# EAGLE design csa_etholi-v1.0b (EAGLE 4.15)
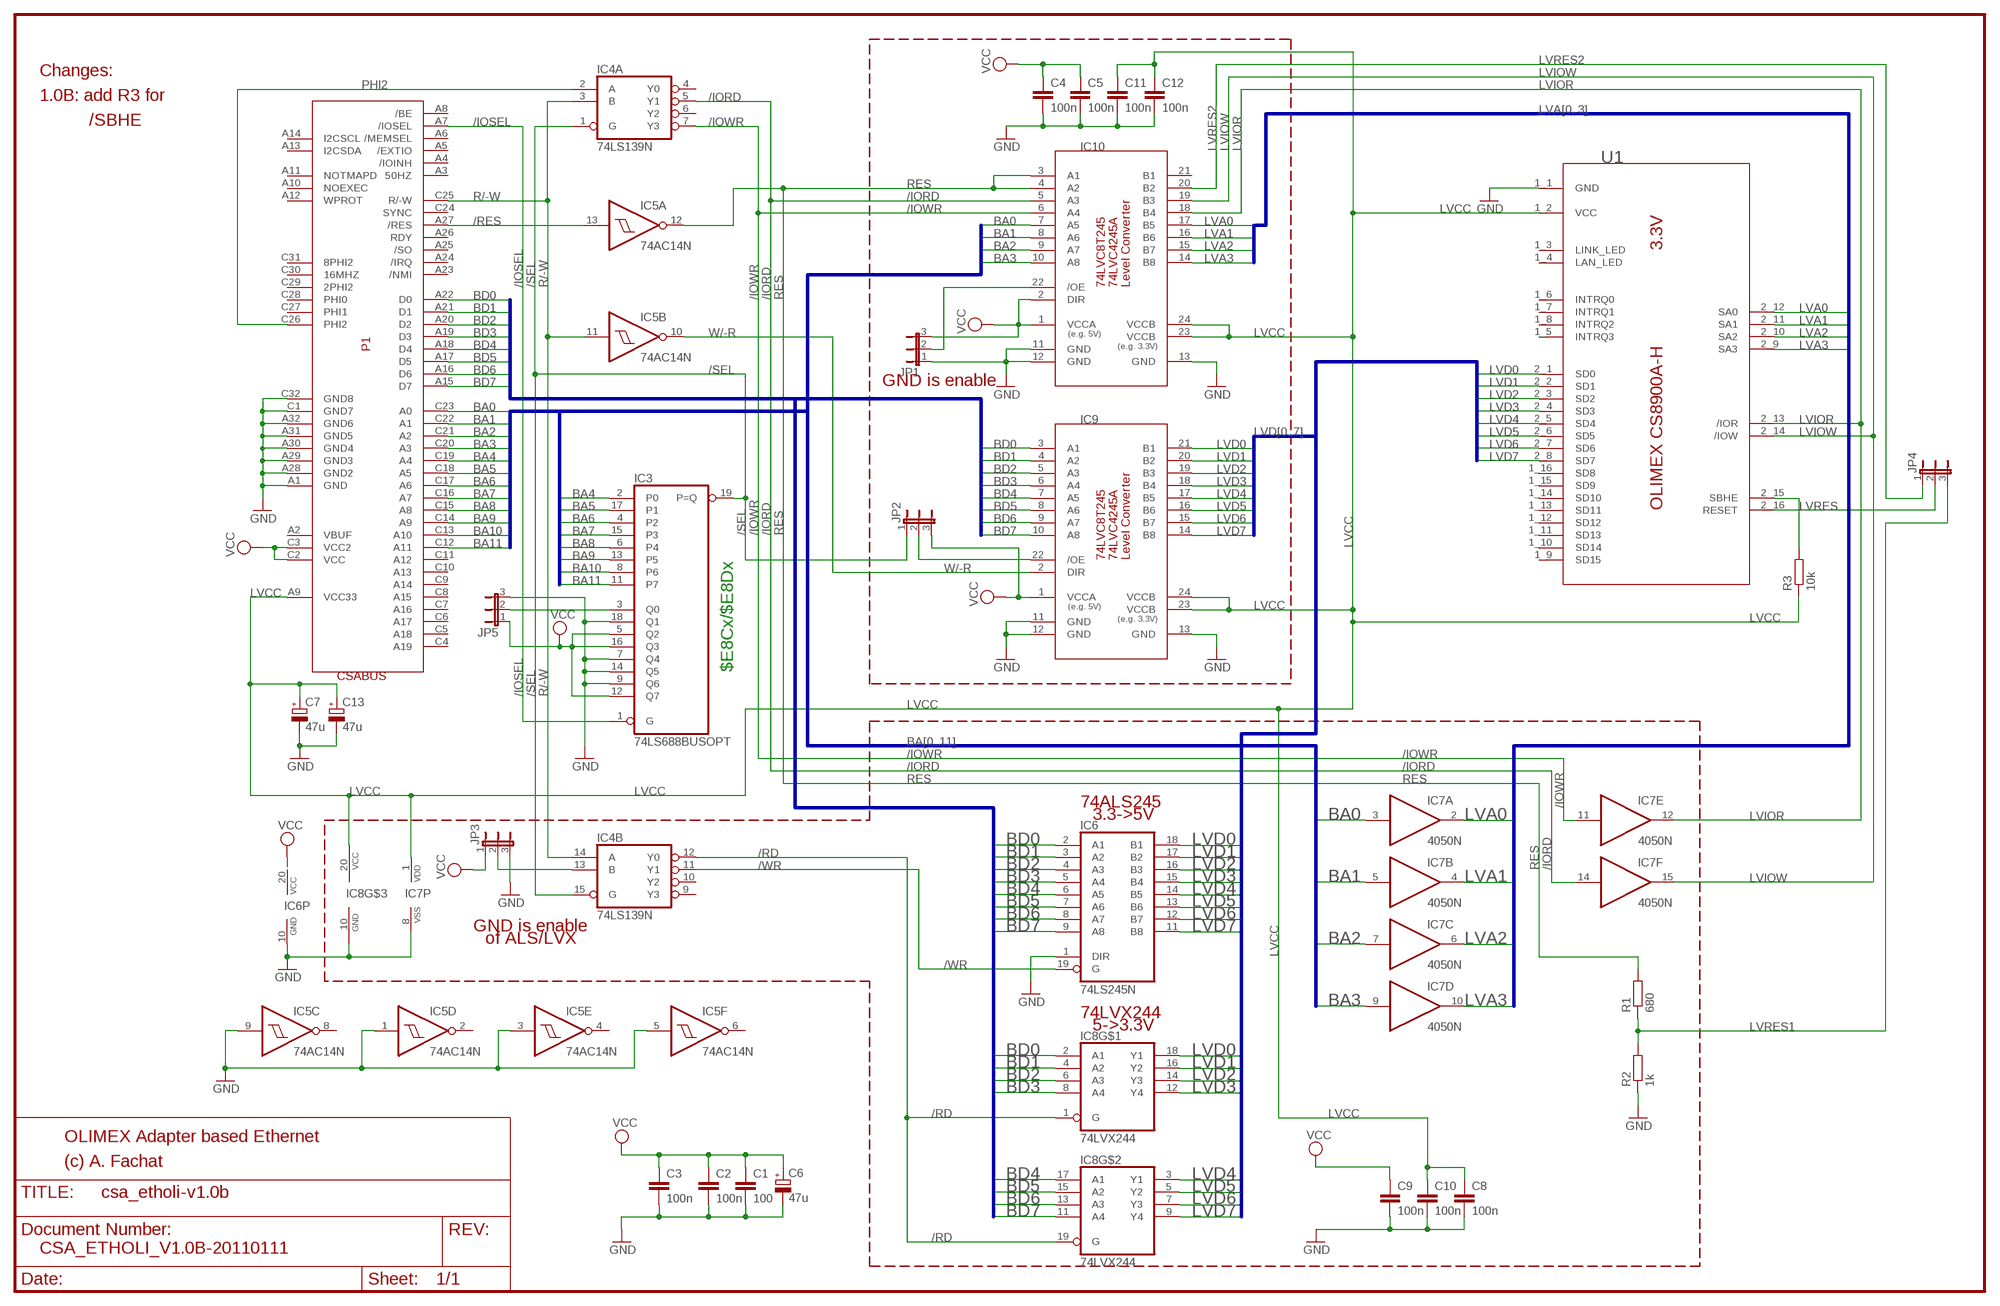
[diagram p0: schematic, sheet 1]

## Parts
C1  100  C-EU025-030X050  [C025-030X050]
C2  100n  C-EU025-030X050  [C025-030X050]
C3  100n  C-EU025-030X050  [C025-030X050]
C4  100n  C-EU025-030X050  [C025-030X050]
C5  100n  C-EU025-030X050  [C025-030X050]
C6  47u  CPOL-EUE3.5-8  [E3,5-8]
C7  47u  CPOL-EUE3.5-8  [E3,5-8]
C8  100n  C-EU025-030X050  [C025-030X050]
C9  100n  C-EU025-030X050  [C025-030X050]
C10  100n  C-EU025-030X050  [C025-030X050]
C11  100n  C-EU025-030X050  [C025-030X050]
C12  100n  C-EU025-030X050  [C025-030X050]
C13  47u  CPOL-EUE3.5-8  [E3,5-8]
IC3  74LS688BUSOPT  [DIL20]
IC4  74LS139N  [DIL16]
IC5  74AC14N  [DIL14]
IC6  74LS245N  [DIL20]
IC7  4050N  [DIL16]
IC8  74LVX244  [SO20L]
IC9  74LVC8T245SO24  [SO24L]
IC10  74LVC8T245SO24  [SO24L]
JP1  JP2E  [JP2]
JP2  JP2E  [JP2]
JP3  JP2E  [JP2]
JP4  JP2E  [JP2]
JP5  JP2E  [JP2]
P1  CSABUS  [CSABUS]
R1  680  R-EU_0207/7  [0207/7]
R2  1k  R-EU_0207/7  [0207/7]
R3  10k  R-EU_0207/7  [0207/7]
U1  ETHOLIMEX  [ETHOLIMEX]

## Nets
/IORD: IC4.5(A:Y1) IC7.14(F:I) IC10.5(A3)
/IOSEL: IC3.1(G) P1.A7(/IOSEL)
/IOWR: IC4.7(A:Y3) IC7.11(E:I) IC10.6(A4)
/RD: IC4.12(B:Y0) IC8.1(G) IC8.19(G)
/RES: IC5.13(A:I) P1.A27(/RES)
/SEL: IC3.19(P=Q) IC4.1(A:G) IC4.15(B:G) JP2.1
/WR: IC4.11(B:Y1) IC6.19(G)
BA0: IC7.3(A:I) IC10.7(A5) P1.C23(A0)
BA1: IC7.5(B:I) IC10.8(A6) P1.C22(A1)
BA2: IC7.7(C:I) IC10.9(A7) P1.C21(A2)
BA3: IC7.9(D:I) IC10.10(A8) P1.C20(A3)
BA4: IC3.2(P0) P1.C19(A4)
BA5: IC3.17(P1) P1.C18(A5)
BA6: IC3.4(P2) P1.C17(A6)
BA7: IC3.15(P3) P1.C16(A7)
BA8: IC3.6(P4) P1.C15(A8)
BA9: IC3.13(P5) P1.C14(A9)
BA10: IC3.8(P6) P1.C13(A10)
BA11: IC3.11(P7) P1.C12(A11)
BD0: IC6.2(A1) IC8.2(A1) IC9.3(A1) P1.A22(D0)
BD1: IC6.3(A2) IC8.4(A2) IC9.4(A2) P1.A21(D1)
BD2: IC6.4(A3) IC8.6(A3) IC9.5(A3) P1.A20(D2)
BD3: IC6.5(A4) IC8.8(A4) IC9.6(A4) P1.A19(D3)
BD4: IC6.6(A5) IC8.17(A1) IC9.7(A5) P1.A18(D4)
BD5: IC6.7(A6) IC8.15(A2) IC9.8(A6) P1.A17(D5)
BD6: IC6.8(A7) IC8.13(A3) IC9.9(A7) P1.A16(D6)
BD7: IC6.9(A8) IC8.11(A4) IC9.10(A8) P1.A15(D7)
GND: C1.2 C2.2 C3.2 C4.2 C5.2 C6.- C7.- C8.2 C9.2 C10.2 C11.2 C12.2 C13.- IC3.7(Q4) IC3.9(Q6) IC3.14(Q5) IC3.18(Q1) IC5.1(D:I) IC5.3(E:I) IC5.5(F:I) IC5.9(C:I) IC6.1(DIR) IC6.10(GND) IC7.8(P:VSS) IC8.10(GND) IC9.11(GND) IC9.12(GND) IC9.13(GND) IC10.11(GND) IC10.12(GND) IC10.13(GND) JP1.1 JP3.3 JP5.3 P1.A1(GND) P1.A28(GND2) P1.A29(GND3) P1.A30(GND4) P1.A31(GND5) P1.A32(GND6) P1.C1(GND7) P1.C32(GND8) R2.1 U1.1_1(GND)
LVA0: IC7.2(A:O) IC10.17(B5) U1.2_12(SA0)
LVA1: IC7.4(B:O) IC10.16(B6) U1.2_11(SA1)
LVA2: IC7.6(C:O) IC10.15(B7) U1.2_10(SA2)
LVA3: IC7.10(D:O) IC10.14(B8) U1.2_9(SA3)
LVCC: C7.+ C8.1 C10.1 C11.1 C12.1 C13.+ IC7.1(P:VDD) IC8.20(VCC) IC9.23(VCCB) IC9.24(VCCB) IC10.23(VCCB) IC10.24(VCCB) P1.A9(VCC33) R3.1 U1.1_2(VCC)
LVD0: IC6.18(B1) IC8.18(Y1) IC9.21(B1) U1.2_1(SD0)
LVD1: IC6.17(B2) IC8.16(Y2) IC9.20(B2) U1.2_2(SD1)
LVD2: IC6.16(B3) IC8.14(Y3) IC9.19(B3) U1.2_3(SD2)
LVD3: IC6.15(B4) IC8.12(Y4) IC9.18(B4) U1.2_4(SD3)
LVD4: IC6.14(B5) IC8.3(Y1) IC9.17(B5) U1.2_5(SD4)
LVD5: IC6.13(B6) IC8.5(Y2) IC9.16(B6) U1.2_6(SD5)
LVD6: IC6.12(B7) IC8.7(Y3) IC9.15(B7) U1.2_7(SD6)
LVD7: IC6.11(B8) IC8.9(Y4) IC9.14(B8) U1.2_8(SD7)
LVIOR: IC7.12(E:O) IC10.18(B4) U1.2_13(/IOR)
LVIOW: IC7.15(F:O) IC10.19(B3) U1.2_14(/IOW)
LVRES: JP4.2 U1.2_16(RESET)
LVRES1: JP4.3 R1.1 R2.2
LVRES2: IC10.20(B2) JP4.1
N$1: IC3.3(Q0) JP5.2
N$2: R3.2 U1.2_15(SBHE)
N$14: IC4.13(B:B) JP3.2
N$15: IC10.22(/OE) JP1.2
N$16: IC9.22(/OE) JP2.2
PHI2: IC4.2(A:A) P1.C26(PHI2)
R/-W: IC4.3(A:B) IC4.14(B:A) IC5.11(B:I) P1.C25(R/-W)
RES: IC5.12(A:O) IC10.3(A1) IC10.4(A2) R1.2
VCC: C1.1 C2.1 C3.1 C4.1 C5.1 C6.+ C9.1 IC3.5(Q2) IC3.12(Q7) IC3.16(Q3) IC6.20(VCC) IC9.1(VCCA) IC10.1(VCCA) IC10.2(DIR) JP1.3 JP2.3 JP3.1 JP5.1 P1.C2(VCC) P1.C3(VCC2)
W/-R: IC5.10(B:O) IC9.2(DIR)
Unconnected: IC4.4(A:Y0) IC4.6(A:Y2) IC4.9(B:Y3) IC4.10(B:Y2) IC5.2(D:O) IC5.4(E:O) IC5.6(F:O) IC5.8(C:O) IC10.21(B1) P1.A2(VBUF) P1.A3(50HZ) P1.A4(/IOINH) P1.A5(/EXTIO) P1.A6(/MEMSEL) P1.A8(/BE) P1.A10(NOEXEC) P1.A11(NOTMAPD) P1.A12(WPROT) P1.A13(I2CSDA) P1.A14(I2CSCL) P1.A23(/NMI) P1.A24(/IRQ) P1.A25(/SO) P1.A26(RDY) P1.C4(A19) P1.C5(A18) P1.C6(A17) P1.C7(A16) P1.C8(A15) P1.C9(A14) P1.C10(A13) P1.C11(A12) P1.C24(SYNC) P1.C27(PHI1) P1.C28(PHI0) P1.C29(2PHI2) P1.C30(16MHZ) P1.C31(8PHI2) U1.1_3(LINK_LED) U1.1_4(LAN_LED) U1.1_5(INTRQ3) U1.1_6(INTRQ0) U1.1_7(INTRQ1) U1.1_8(INTRQ2) U1.1_9(SD15) U1.1_10(SD14) U1.1_11(SD13) U1.1_12(SD12) U1.1_13(SD11) U1.1_14(SD10) U1.1_15(SD9) U1.1_16(SD8)

## Buses
LVD[0..7]
BD[0..7]
BA[0..11]
LVA[0..3]

## Notes on the sheet
- Changes:
- 1.0B: add R3 for
- /SBHE
- GND is enable
- $E8Cx/$E8Dx
- 74ALS245
- 3.3->5V
- GND is enable
- of ALS/LVX
- 74LVX244
- 5->3.3V
- OLIMEX Adapter based Ethernet
- (c) A. Fachat
- CSA_ETHOLI_V1.0B-20110111

## Power pins joined to a net without a drawn wire
GND: IC3.10(GND) IC4.8(P:GND) IC5.7(P:GND)
VCC: IC3.20(VCC) IC4.16(P:VCC) IC5.14(P:VCC)

## Library data of the parts
C1-C5 C8-C12 = rcl:C-EU: CAPACITOR, European symbol
C6 C7 C13 = rcl:CPOL-EU: POLARIZED CAPACITOR, European symbol
IC3 = csa:74LS688BUSOPT
IC4 = 74xx-us:74*139: Dual 2-line to 4-line DECODER/DEMULTIPLEXER
IC5 = 74xx-eu:74*14: Hex schmitt trigger INVERTER
IC6 = 74xx-eu:74*245: Octal BUS TRANSCEIVER, 3-state
IC7 = 40xx:4050: Hex non-inverting BUFFER
IC8 = csa:74LVX244
IC9 IC10 = csa:74LVC8T245
JP1-JP5 = jumper:JP2E: JUMPER
P1 = csa:CSABUS
R1-R3 = rcl:R-EU_: RESISTOR, European symbol
U1 = csa:ETHOLIMEX

## Board
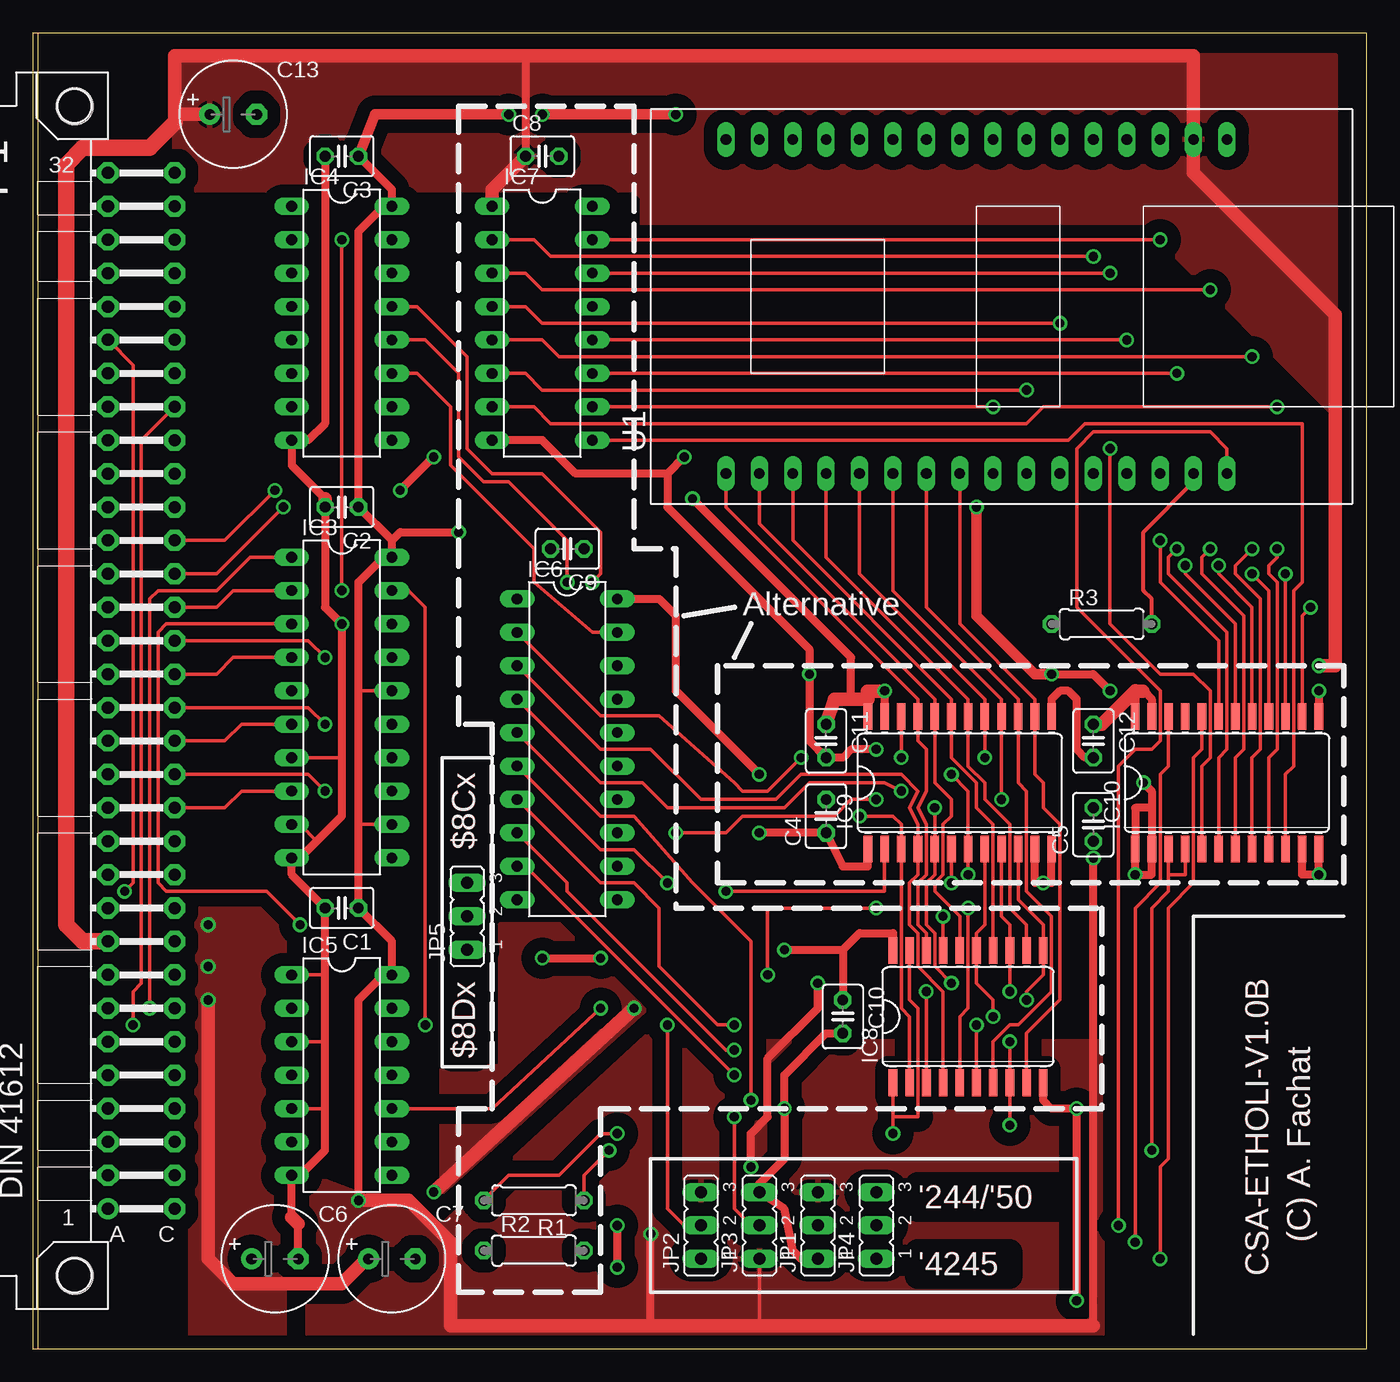
[diagram p1: board, top side]
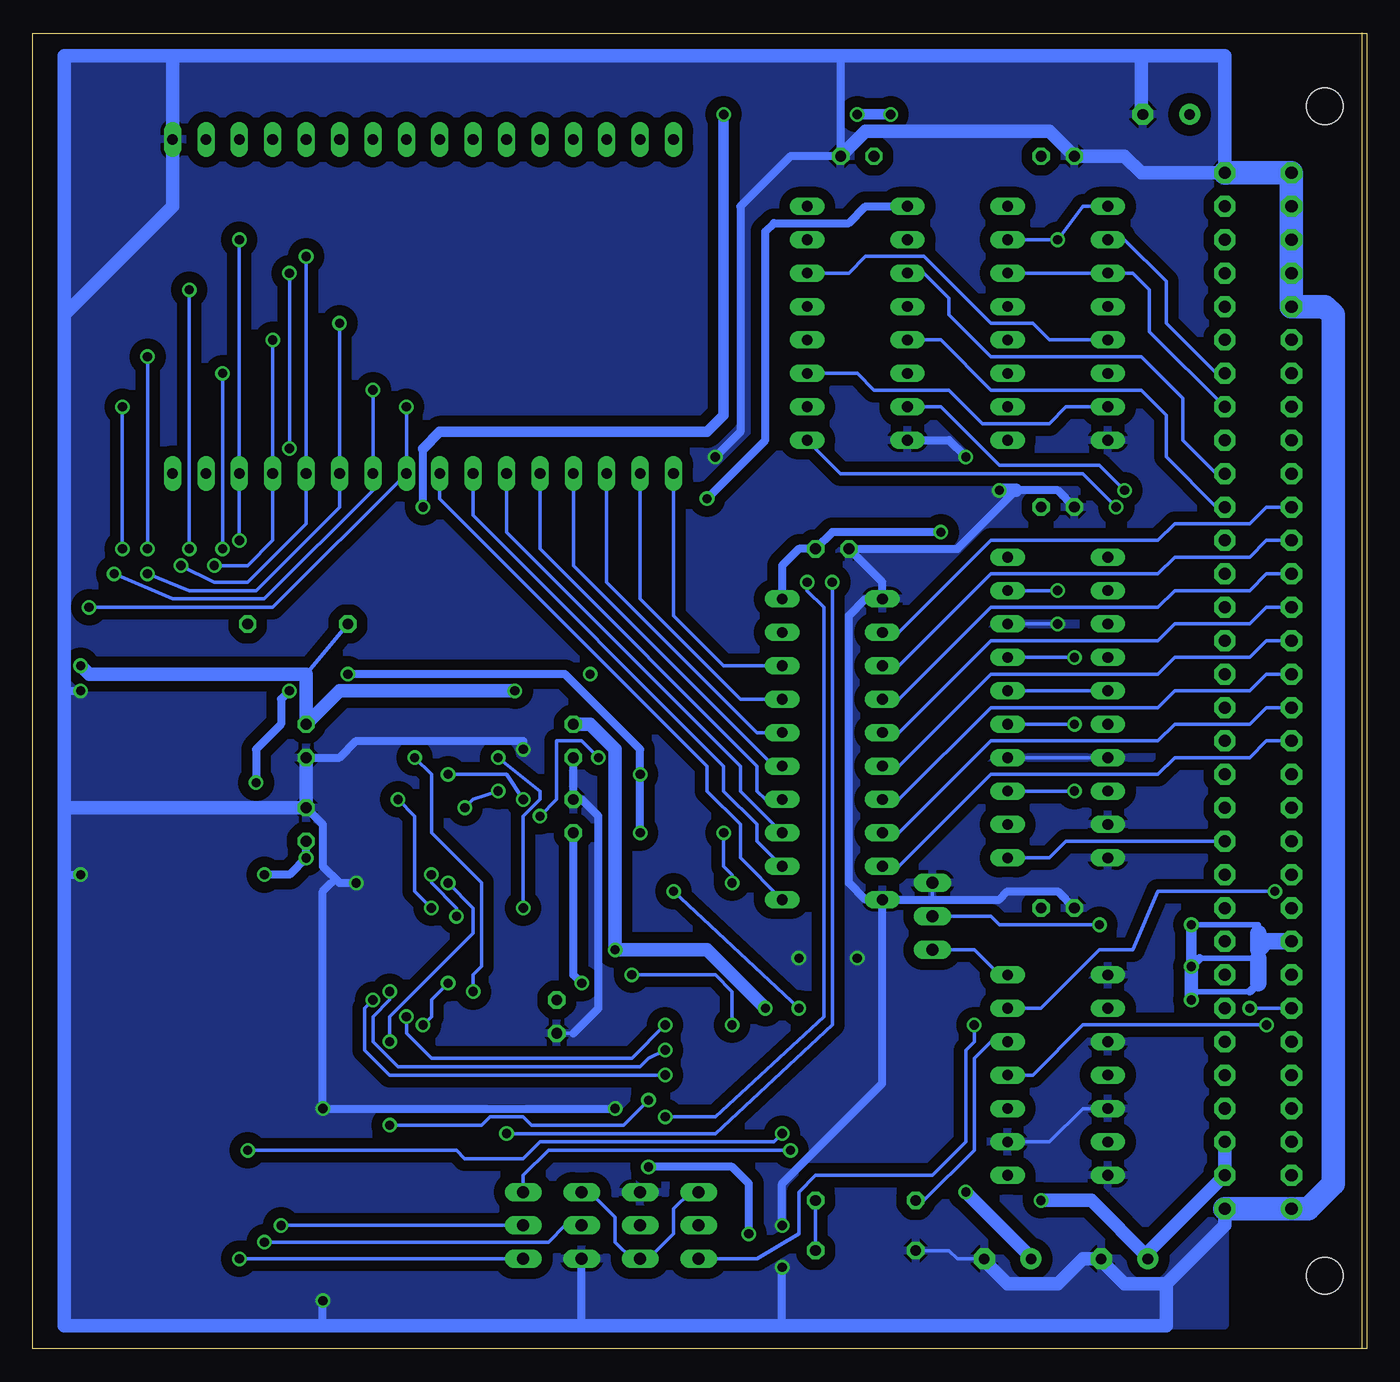
[diagram p2: board, bottom side, seen from below]

Size 101.42 x 100.03 mm. Coordinates in mm from the lower left corner, seen from the top.
Outline: 0,0.01 101.42,0.01 101.42,100.01 0,100.01 0,0.01
Copper layers (1*16): Top 0.035mm / dielectric 1.5mm / Bottom 0.035mm
Design rules "default": minimum track width 10mil, minimum drill 24mil, track to track 6mil, track to pad 6mil, pad to pad 8mil, via to via 8mil, smd to smd 8mil, copper to edge 40mil, drill to drill 8mil, minimum pad ring 10mil, minimum via ring 8mil, stop-mask expansion 4mil, vias tented up to drill 0mil, thermal gap 10mil

### Footprints (pad centres in the part's own frame; a part is rotated, then mirrored left to right if it is on the bottom)
C025-030X050 = drill 0.813 octagon: 1 -1.27,0; 2 1.27,0
E3,5-8 = drill 0.813 pad 1.6 round: + -1.778,0 | drill 0.813 pad 1.6 octagon: - 1.778,0
DIL20 = drill 0.813 long: 1 -10.16,-3.81; 2 -7.62,-3.81; 3 -5.08,-3.81; 4 -2.54,-3.81; 5 0,-3.81; 6 2.54,-3.81; 7 5.08,-3.81; 8 7.62,-3.81; 9 10.16,-3.81; 10 12.7,-3.81; 11 12.7,3.81; 12 10.16,3.81; 13 7.62,3.81; 14 5.08,3.81; 15 2.54,3.81; 16 0,3.81; 17 -2.54,3.81; 18 -5.08,3.81; 19 -7.62,3.81; 20 -10.16,3.81
DIL16 = drill 0.813 long: 1 -8.89,-3.81; 2 -6.35,-3.81; 3 -3.81,-3.81; 4 -1.27,-3.81; 5 1.27,-3.81; 6 3.81,-3.81; 7 6.35,-3.81; 8 8.89,-3.81; 9 8.89,3.81; 10 6.35,3.81; 11 3.81,3.81; 12 1.27,3.81; 13 -1.27,3.81; 14 -3.81,3.81; 15 -6.35,3.81; 16 -8.89,3.81
DIL14 = drill 0.813 long: 1 -7.62,-3.81; 2 -5.08,-3.81; 3 -2.54,-3.81; 4 0,-3.81; 5 2.54,-3.81; 6 5.08,-3.81; 7 7.62,-3.81; 8 7.62,3.81; 9 5.08,3.81; 10 2.54,3.81; 11 0,3.81; 12 -2.54,3.81; 13 -5.08,3.81; 14 -7.62,3.81
DIL20' = drill 0.813 long: 1 -11.43,-3.81; 2 -8.89,-3.81; 3 -6.35,-3.81; 4 -3.81,-3.81; 5 -1.27,-3.81; 6 1.27,-3.81; 7 3.81,-3.81; 8 6.35,-3.81; 9 8.89,-3.81; 10 11.43,-3.81; 11 11.43,3.81; 12 8.89,3.81; 13 6.35,3.81; 14 3.81,3.81; 15 1.27,3.81; 16 -1.27,3.81; 17 -3.81,3.81; 18 -6.35,3.81; 19 -8.89,3.81; 20 -11.43,3.81
SO20L = smd 0.66 x 2.032: 1 0,-5.029; 2 1.27,-5.029; 3 2.54,-5.029; 4 3.81,-5.029; 5 5.08,-5.029; 6 6.35,-5.029; 7 7.62,-5.029; 8 8.89,-5.029; 9 10.16,-5.029; 10 11.43,-5.029; 11 11.43,5.029; 12 10.16,5.029; 13 8.89,5.029; 14 7.62,5.029; 15 6.35,5.029; 16 5.08,5.029; 17 3.81,5.029; 18 2.54,5.029; 19 1.27,5.029; 20 0,5.029
SO24L = smd 0.66 x 2.032: 1 -3.81,-5.029; 2 -2.54,-5.029; 3 -1.27,-5.029; 4 0,-5.029; 5 1.27,-5.029; 6 2.54,-5.029; 7 3.81,-5.029; 8 5.08,-5.029; 9 6.35,-5.029; 10 7.62,-5.029; 11 8.89,-5.029; 12 10.16,-5.029; 13 10.16,5.029; 14 8.89,5.029; 15 7.62,5.029; 16 6.35,5.029; 17 5.08,5.029; 18 3.81,5.029; 19 2.54,5.029; 20 1.27,5.029; 21 0,5.029; 22 -1.27,5.029; 23 -2.54,5.029; 24 -3.81,5.029
JP2 = drill 0.914 long: 1 -2.54,0; 2 0,0; 3 2.54,0
CSABUS = drill 0.914 pad 1.6 round: A1 7.62,36.83 | drill 0.914 pad 1.6 octagon: A2 7.62,34.29; A3 7.62,31.75; A4 7.62,29.21; A5 7.62,26.67; A6 7.62,24.13; A7 7.62,21.59; A8 7.62,19.05; A9 7.62,16.51; A10 7.62,13.97; A11 7.62,11.43; A12 7.62,8.89; A13 7.62,6.35; A14 7.62,3.81; A15 7.62,1.27; A16 7.62,-1.27; A17 7.62,-3.81; A18 7.62,-6.35; A19 7.62,-8.89; A20 7.62,-11.43; A21 7.62,-13.97; A22 7.62,-16.51; A23 7.62,-19.05; A24 7.62,-21.59; A25 7.62,-24.13; A26 7.62,-26.67; A27 7.62,-29.21; A28 7.62,-31.75; A29 7.62,-34.29; A30 7.62,-36.83; A31 7.62,-39.37; A32 7.62,-41.91; C1 2.54,36.83; C2 2.54,34.29; C3 2.54,31.75; C4 2.54,29.21; C5 2.54,26.67; C6 2.54,24.13; C7 2.54,21.59; C8 2.54,19.05; C9 2.54,16.51; C10 2.54,13.97; C11 2.54,11.43; C12 2.54,8.89; C13 2.54,6.35; C14 2.54,3.81; C15 2.54,1.27; C16 2.54,-1.27; C17 2.54,-3.81; C18 2.54,-6.35; C19 2.54,-8.89; C20 2.54,-11.43; C21 2.54,-13.97; C22 2.54,-16.51; C23 2.54,-19.05; C24 2.54,-21.59; C25 2.54,-24.13; C26 2.54,-26.67; C27 2.54,-29.21; C28 2.54,-31.75; C29 2.54,-34.29; C30 2.54,-36.83; C31 2.54,-39.37; C32 2.54,-41.91 | hole 2.794: 10.16,41.91; 10.16,-46.99
0207/7 = drill 0.813 octagon: 1 -3.81,0; 2 3.81,0
ETHOLIMEX = drill 0.813 long: 1_1 20.32,17.78; 1_2 17.78,17.78; 1_3 15.24,17.78; 1_4 12.7,17.78; 1_5 10.16,17.78; 1_6 7.62,17.78; 1_7 5.08,17.78; 1_8 2.54,17.78; 1_9 0,17.78; 1_10 -2.54,17.78; 1_11 -5.08,17.78; 1_12 -7.62,17.78; 1_13 -10.16,17.78; 1_14 -12.7,17.78; 1_15 -15.24,17.78; 1_16 -17.78,17.78; 2_1 -17.78,-7.62; 2_2 -15.24,-7.62; 2_3 -12.7,-7.62; 2_4 -10.16,-7.62; 2_5 -7.62,-7.62; 2_6 -5.08,-7.62; 2_7 -2.54,-7.62; 2_8 0,-7.62; 2_9 2.54,-7.62; 2_10 5.08,-7.62; 2_11 7.62,-7.62; 2_12 10.16,-7.62; 2_13 12.7,-7.62; 2_14 15.24,-7.62; 2_15 17.78,-7.62; 2_16 20.32,-7.62

### Placement (x,y rotation side)
C1  23.49,33.5 180 top
C2  23.49,63.98 180 top
C3  23.49,90.65 180 top
C4  60.32,40.49 90 top
C5  80.64,39.85 90 top
C6  18.41,6.83 0 top
C7  27.3,6.83 0 top
C8  38.73,90.65 0 top
C9  40.64,60.81 180 top
C10  61.59,25.25 270 top
C11  60.32,46.2 270 top
C12  80.64,46.2 270 top
C13  15.24,93.83 0 top
IC3  23.49,50.01 270 top
IC4  23.49,77.95 270 top
IC5  23.49,20.8 270 top
IC6  74LS245N  [DIL20']  40.64,45.57 270 top
IC7  38.73,77.95 270 top
IC8  65.4,25.25 0 top
IC9  67.3,43.03 0 top
IC10  87.62,43.03 0 top
JP1  59.69,9.37 90 top
JP2  50.8,9.37 90 top
JP3  55.24,9.37 90 top
JP4  64.13,9.37 90 top
JP5  33.02,32.87 90 top
P1  13.33,47.47 180 top
R1  38.1,11.28 180 top
R2  38.1,7.47 0 top
R3  81.27,55.09 0 top
U1  70.48,74.14 0 top

### Tracks (layer width: path | path; a pad name or v marks a point on that pad's centre or on a via)
/IORD  (via drill 0.7)
  Top 0.254: IC10.5 88.89,44.3 89.53,44.93 89.53,50.01 88.26,51.28 85.72,51.28 81.91,55.09 v81.91,68.43 | IC7.14 v81.91,81.76
  Bottom 0.254: IC4.5 24.12,76.68 25.39,77.95 28.57,77.95 33.65,83.03 38.1,83.03 39.37,81.76 IC7.14 | v81.91,81.76 v81.91,68.43
/IOSEL  (via drill 0.7)
  Top 0.254: v8.89,25.88 8.89,57 9.52,57.63 13.97,57.63 16.5,60.17 IC3.1
  Bottom 0.254: P1.A7 v8.89,25.88
/IOWR  (via drill 0.7)
  Top 0.254: IC10.6 90.16,44.93 90.8,45.57 90.8,54.46 86.35,58.9 86.35,60.17 v86.99,60.81 | IC7.11 v86.99,74.14
  Bottom 0.254: v86.99,74.14 v86.99,60.81 | IC4.7 22.86,71.6 24.12,70.33 29.2,70.33 31.74,72.87 37.46,72.87 38.73,74.14 IC7.11
/RD  (via drill 0.7)
  Top 0.254: 65.4,17.63 IC8.1 | 65.4,17.63 67.3,17.63 67.3,25.88 66.67,26.52 IC8.19 66.67,30.33 | IC4.12 29.84,76.68 32.38,74.14 32.38,67.79 34.29,65.89 36.19,65.89 40.64,61.44 v40.64,58.27 | v65.4,16.36 65.4,17.63
  Bottom 0.254: v40.64,58.27 40.64,24.61 49.53,16.36 v65.4,16.36
/RES  (via drill 0.7)
  Top 0.254: P1.A27 7.62,74.78 7.62,35.41 v6.98,34.77
  Bottom 0.254: v6.98,34.77 15.87,34.77 17.77,30.33 20.31,30.33 24.76,25.88 IC5.13
/SEL  (via drill 0.7)
  Top 0.254: v23.49,57.63 v23.49,84.3 | IC3.19 28.57,57.63 29.84,56.36 v29.84,24.61
  Bottom 0.254: IC4.1 21.58,86.84 v23.49,84.3 IC4.15 | IC3.19 v23.49,57.63 | v29.84,24.61 29.84,23.34 30.47,22.71 30.47,15.72 33.02,13.18 41.91,13.18 43.18,11.91 43.18,8.74 46.35,6.83 JP2.1
/WR
  Top 0.254: IC4.11 29.2,74.14 31.74,71.6 31.74,67.16 38.1,60.81 38.1,58.27 42.54,54.46 IC6.19
BA0  (via drill 0.7)
  Top 0.254: IC10.7 91.44,44.93 92.07,45.57 92.07,55.73 88.89,58.9 88.89,60.17 v89.53,60.81 | v89.53,80.49 38.73,80.49 37.46,81.76 IC7.3
  Bottom 0.254: P1.C23 11.43,66.52 13.97,69.06 13.97,72.24 17.14,75.41 28.57,75.41 31.74,78.59 31.74,79.86 33.65,81.76 IC7.3 | v89.53,80.49 v89.53,60.81
BA1  (via drill 0.7)
  Top 0.254: IC10.8 92.7,44.93 93.34,45.57 93.34,57 91.44,58.9 91.44,59.54 92.07,60.17 v92.7,60.81 | v92.7,75.41 40,75.41 38.73,76.68 IC7.5
  Bottom 0.254: P1.C22 11.43,63.98 15.24,67.79 15.24,70.97 17.14,72.87 28.57,72.87 32.38,76.68 IC7.5 | v92.7,75.41 v92.7,60.81
BA2  (via drill 0.7)
  Top 0.254: P1.C21 14.6,61.44 v18.41,65.25 | IC10.9 93.97,44.93 94.61,45.57 94.61,58.27 93.97,58.9 93.97,59.54 94.61,60.17 v94.61,60.81 | v94.61,71.6 76.83,71.6 75.56,70.33 39.37,70.33 38.1,71.6 IC7.7
  Bottom 0.254: v18.41,65.25 20.31,67.16 27.93,67.16 32.38,71.6 IC7.7 | v94.61,71.6 v94.61,60.81
BA3  (via drill 0.7)
  Top 0.254: P1.C20 13.97,58.9 v19.04,63.98 | IC10.10 95.24,43.66 95.88,44.3 95.88,57.63 96.52,58.27 96.52,70.33 80,70.33 78.73,69.06 IC7.9
  Bottom 0.254: v19.04,63.98 21.58,66.52 40,66.52 IC7.9
BA4
  Top 0.254: P1.C19 13.97,56.36 15.24,57.63 IC3.2
BA5  (via drill 0.7)
  Top 0.254: P1.C18 20.95,53.82 v22.22,52.55
  Bottom 0.254: v22.22,52.55 IC3.17
BA6
  Top 0.254: P1.C17 13.97,51.28 15.24,52.55 IC3.4
BA7  (via drill 0.7)
  Top 0.254: P1.C16 20.95,48.74 v22.22,47.47
  Bottom 0.254: v22.22,47.47 IC3.15
BA8
  Top 0.254: P1.C15 14.6,46.2 15.87,47.47 IC3.6
BA9  (via drill 0.7)
  Top 0.254: P1.C14 20.95,43.66 v22.22,42.39
  Bottom 0.254: v22.22,42.39 IC3.13
BA10
  Top 0.254: P1.C13 14.6,41.12 15.87,42.39 IC3.8
BA11
  Bottom 0.254: P1.C12 22.86,38.58 24.12,37.31 IC3.11
BD0  (via drill 0.7)
  Top 0.254: 66.03,37.95 66.03,25.88 66.67,25.25 IC8.2 66.67,20.17 | IC6.2 43.18,48.11 47.62,48.11 53.34,43.03 53.97,42.39 55.88,42.39 v58.41,44.93 | v62.86,40.49 65.4,40.49 66.03,39.85 66.03,37.95 | 66.03,37.95 IC9.3
  Bottom 0.254: P1.A22 7.62,63.98 8.89,62.71 14.6,62.71 15.87,61.44 28.57,61.44 35.55,54.46 IC6.2 | v58.41,44.93 59.69,46.2 61.59,46.2 61.59,41.76 v62.86,40.49
BD1
  Top 0.254: 67.3,37.95 67.3,36.04 66.67,35.41 66.67,32.23 67.3,31.6 67.3,29.06 69.21,27.15 IC8.4 69.21,20.17 | IC6.3 43.18,45.57 46.98,45.57 50.8,41.76 56.51,41.76 58.41,43.66 66.03,43.66 67.3,42.39 66.67,41.12 67.3,39.85 67.3,37.95 | 67.3,37.95 IC9.4
  Bottom 0.254: P1.A21 7.62,61.44 8.89,60.17 14.6,60.17 15.87,58.9 28.57,58.9 35.55,51.92 IC6.3
BD2  (via drill 0.7)
  Top 0.254: 68.57,37.95 68.57,36.04 67.94,35.41 67.94,32.23 68.57,31.6 68.57,29.06 v69.84,27.79 | 71.75,20.17 IC8.6 v71.75,24.61 | IC6.4 43.18,43.03 46.35,43.03 48.26,41.12 57.15,41.12 59.05,43.03 64.77,43.03 v66.03,42.39 | 68.57,37.95 IC9.5 | v68.57,41.12 68.57,37.95
  Bottom 0.254: P1.A20 7.62,58.9 8.89,57.63 14.6,57.63 15.87,56.36 28.57,56.36 35.55,49.38 IC6.4 | v69.84,27.79 71.11,26.52 71.11,25.25 v71.75,24.61 | v66.03,42.39 67.94,41.76 v68.57,41.12
BD3  (via drill 0.7)
  Top 0.254: v69.84,35.41 IC9.6 | 74.29,20.17 IC8.8 74.29,20.8 | 74.29,20.8 v74.29,23.34 | IC6.5 43.18,40.49 45.72,40.49 50.16,35.41 54.61,30.96 v54.61,18.9 | v74.29,16.99 74.29,20.8
  Bottom 0.254: P1.A19 7.62,56.36 8.89,55.09 14.6,55.09 15.87,53.82 28.57,53.82 35.55,46.84 IC6.5 | v69.84,35.41 67.94,33.5 67.94,31.6 74.29,25.25 v74.29,23.34 | v54.61,18.9 56.51,16.99 63.5,16.99 64.13,17.63 66.67,17.63 67.3,16.99 v74.29,16.99
BD4  (via drill 0.7)
  Top 0.254: v69.21,32.87 IC8.17 | 71.11,37.95 v71.11,36.04 | 71.11,37.95 IC9.7 | IC6.6 43.18,37.95 45.72,37.95 v48.26,35.41 | 71.11,37.95 71.11,42.39 v69.84,43.66 | v64.13,41.76 62.23,41.76 60.96,40.49 53.97,40.49 52.7,39.22 v48.89,39.22
  Bottom 0.254: P1.A18 7.62,53.82 8.89,52.55 14.6,52.55 15.87,51.28 28.57,51.28 35.55,44.3 IC6.6 | v69.21,32.87 69.21,33.5 71.11,35.41 v71.11,36.04 | v64.13,41.76 65.4,43.66 v69.84,43.66 | v48.26,35.41 48.26,36.04 48.89,36.68 v48.89,39.22
BD5  (via drill 0.7)
  Top 0.254: IC9.8 72.38,32.23 71.75,31.6 71.75,30.33 | IC6.7 43.18,35.41 45.72,35.41 47.62,33.5 47.62,29.06 52.07,24.61 v53.34,24.61 | v73.02,25.25 73.02,26.52 71.75,27.79 71.75,30.33 | 71.75,30.33 IC8.15
  Bottom 0.254: P1.A17 7.62,51.28 8.89,50.01 14.6,50.01 15.87,48.74 28.57,48.74 35.55,41.76 IC6.7 | v53.34,24.61 55.88,22.07 71.11,22.07 73.02,23.98 v73.02,25.25
BD6  (via drill 0.7)
  Top 0.254: 74.29,30.33 74.29,32.23 73.66,32.87 IC9.9 | IC6.8 40.64,35.41 40.64,34.77 52.7,22.71 v53.34,22.71 | 74.29,30.33 IC8.13 | v74.29,27.15 74.29,30.33
  Bottom 0.254: P1.A16 7.62,48.74 8.89,47.47 14.6,47.47 15.87,46.2 28.57,46.2 35.55,39.22 IC6.8 | v53.34,22.71 54.61,22.07 55.24,21.44 73.66,21.44 75.56,23.34 75.56,25.25 74.29,26.52 v74.29,27.15
BD7  (via drill 0.7)
  Top 0.254: IC9.10 74.92,34.14 76.83,32.23 76.83,30.33 | IC6.9 37.46,36.68 v53.34,20.8 | v75.56,26.52 75.56,27.15 76.83,28.42 76.83,30.33 | 76.83,30.33 IC8.11
  Bottom 0.254: P1.A15 7.62,46.2 8.89,44.93 14.6,44.93 15.87,43.66 28.57,43.66 35.55,36.68 IC6.9 | v53.34,20.8 74.29,20.8 76.19,22.71 76.19,25.88 v75.56,26.52
GND  (via drill 0.7)
  Top 0.254: 22.22,18.26 IC5.5 | 22.22,23.34 IC5.3 | 22.22,28.42 IC5.1 | 23.49,44.93 IC3.7 | v97.78,36.04 IC10.12 | C12.2 80,44.93 | JP3.3 55.24,12.55 | IC3.9 20.31,39.85 21.58,38.58
  Top 0.61: C6.- 20.19,9.5 | 19.68,10.01 IC5.7 | 20.31,13.18 22.22,15.09 22.22,18.26 22.22,23.34 22.22,28.42 C1.2 19.68,36.04 IC3.10 | 20.31,37.31 21.58,38.58 23.49,40.49 23.49,44.93 v23.49,55.09 22.22,56.36 C2.2 | 22.22,64.62 19.68,67.16 IC4.8 20.95,69.06 22.22,70.33 C3.2 | v97.78,50.01 IC10.13 | v27.93,65.25 v30.47,67.79 | 80,44.93 79.37,45.57 79.37,49.38 78.73,50.01 78.1,50.01 77.46,49.38 IC9.13 | JP3.3 57.15,10.64 57.78,7.47 58.41,6.83 JP1.1 | 55.24,12.55 57.15,14.45 v57.15,18.26 57.15,20.8 60.32,23.98 C10.2 | IC8.10 76.83,18.9 77.46,18.26 v79.37,18.26 v79.37,3.66 | IC10.12 v97.78,36.04 96.52,36.04 IC10.11 | IC9.11 76.19,35.41 v76.83,35.41 77.46,35.41 IC9.12 | IC7.8 38.73,69.06 41.27,66.52 48.26,66.52 | v49.53,67.79 48.26,66.52 | v44.45,6.2 v44.45,9.37 | 48.26,66.52 48.26,63.98 59.05,53.19 v59.05,51.28 59.05,46.2 C11.2 61.59,44.93 62.23,45.57 v64.13,45.57 | v38.73,29.69 v43.18,29.69
  Top 1.016: 20.19,9.5 19.68,10.01 | IC5.7 20.31,13.18 | IC3.10 20.31,37.31 | 22.22,64.62 C2.2
  Bottom 0.254: IC5.5 21.58,18.26 24.12,15.72 IC5.9 | IC3.7 IC3.14 | C10.2 60.32,23.98 | 29.2,6.83 31.11,6.83 31.74,7.47 R2.1 | 33.02,34.14 JP5.3 | v23.49,55.09 IC3.18
  Bottom 0.61: C2.2 23.49,65.25 26.66,65.25 31.11,60.81 C9.2 36.83,58.27 IC6.1 38.1,57 39.37,55.73 39.37,35.41 38.1,34.14 IC6.10 | C1.2 23.49,34.77 27.3,34.77 27.93,34.14 33.02,34.14 IC6.10 | C11.2 C4.2 59.69,41.76 58.41,40.49 58.41,25.88 60.32,23.98 | 99.05,50.01 v97.78,50.01 | 99.05,36.04 v97.78,36.04 | v30.47,67.79 31.74,69.06 IC7.8 | v57.15,18.26 v79.37,18.26 79.37,34.77 78.73,35.41 | 79.37,1.75 v79.37,3.66 | v76.83,35.41 78.1,35.41 79.37,36.68 79.37,39.85 C5.2 | 59.69,1.75 JP1.1 | 40,98.27 C8.2 43.81,90.65 47.62,86.84 47.62,69.7 v49.53,67.79 | IC6.10 36.83,20.17 44.45,12.55 v44.45,9.37 | 44.45,1.75 v44.45,6.2 | C12.2 78.1,44.93 76.83,46.2 64.13,46.2 v64.13,45.57
  Bottom 1.016: P1.C1 10.79,9.37 15.24,4.93 | 20.31,6.83 C6.- | 15.24,4.93 18.41,4.93 20.31,6.83 | C8.2 38.1,92.56 24.12,92.56 C3.2 18.41,90.65 17.14,89.38 P1.C32 10.79,98.27 17.14,98.27 | 99.05,78.59 90.8,86.84 U1.1_1 90.8,98.27 | 99.05,78.59 99.05,50.01 99.05,41.12 | 99.05,41.12 99.05,36.04 99.05,1.75 79.37,1.75 59.69,1.75 44.45,1.75 15.24,1.75 15.24,4.93 | 26.66,65.25 v27.93,65.25 | C12.2 C5.2 99.05,41.12 | 99.05,78.59 99.05,98.27 90.8,98.27 | 17.14,98.27 40,98.27 90.8,98.27 | 20.31,6.83 21.58,6.83 23.49,4.93 27.3,4.93 29.2,6.83 C7.- | 17.14,98.27 17.14,93.83
  Bottom 1.778: P1.A1 P1.C1 4.44,10.64 2.54,12.55 2.54,78.59 3.17,79.22 P1.A28 P1.A29 P1.A30 P1.A31 P1.A32 P1.C32
  pour Bottom (isolate 0.813): 10.79,98.27 10.79,1.75 99.05,1.75 99.05,98.27
LVA0  (via drill 0.7)
  Top 0.254: v90.16,59.54 90.16,58.9 92.7,56.36 IC10.17 | v80.64,83.03 39.37,83.03 38.1,84.3 IC7.2
  Bottom 0.254: v90.16,59.54 87.62,58.27 85.08,58.27 80.64,62.71 U1.2_12 v80.64,83.03
LVA1  (via drill 0.7)
  Top 0.254: v92.7,58.9 93.97,57.63 IC10.16 | v78.1,77.95 38.73,77.95 37.46,79.22 IC7.4
  Bottom 0.254: v92.7,58.9 89.53,57.63 84.45,57.63 78.1,63.98 U1.2_11 v78.1,77.95
LVA2  (via drill 0.7)
  Top 0.254: v95.24,58.9 IC10.15 | v75.56,72.87 38.73,72.87 37.46,74.14 IC7.6
  Bottom 0.254: v95.24,58.9 90.8,57 83.81,57 75.56,65.25 U1.2_10 v75.56,72.87
LVA3  (via drill 0.7)
  Top 0.254: v97.15,56.36 96.52,55.73 IC10.14 | IC7.10 v73.02,71.6
  Bottom 0.254: v97.15,56.36 83.18,56.36 U1.2_9 v73.02,71.6
LVCC  (via drill 0.7)
  Top 0.254: 64.71,49.96 v64.77,50.01 IC9.23 | 65.4,30.33 IC8.20 | 85.08,48.11 IC10.23 | 83.81,50.01 83.87,49.96
  Top 0.61: 63.5,49.38 IC9.24 63.44,49.96 | 61.59,30.33 C10.1 | 61.59,30.33 62.86,31.6 65.4,31.6 65.4,30.33 | v57.15,30.33 61.59,30.33 | v64.77,50.01 IC9.23 | 83.81,50.01 IC10.24 | 84.4,49.96 84.5,49.96 85.08,49.38 85.08,48.11 | v50.16,64.62 62.23,52.55 62.23,49.38 | 37.46,98.27 C8.1
  Top 1.016: v13.33,26.52 13.33,6.83 15.24,4.93 23.49,4.93 25.39,6.83 C7.+ | IC7.1 34.92,88.11 C8.1 | C11.1 60.96,49.38 62.23,49.38 63.5,49.38 | 63.44,49.96 64.71,49.96 | C12.1 81.27,47.47 83.81,50.01 | 83.87,49.96 84.4,49.96 | v97.78,51.92 99.05,51.92 99.05,78.59 88.26,89.38 U1.1_2 88.26,98.27 37.46,98.27 10.79,98.27 10.79,93.83 | v30.47,11.91 v45.72,25.88 | 10.79,93.19 10.79,93.83 | 10.79,93.83 C13.+
  Top 1.27: P1.A9 3.8,30.96 2.54,32.23 2.54,90.02 3.8,91.29 8.89,91.29 10.79,93.19
  Bottom 0.305: 80.64,51.28 R3.1
  Bottom 0.406: 13.33,27.15 8.89,27.15 | 12.7,29.69 8.25,29.69 | v13.33,32.23 8.25,32.23
  Bottom 0.61: 8.25,29.69 8.25,30.33 | 8.89,27.15 8.25,27.79 | v13.33,29.06 12.7,29.69 | IC7.1 38.1,86.84 39.37,85.57 45.08,85.57 45.72,84.94 45.72,69.06 v50.16,64.62
  Bottom 0.813: v13.33,29.06 v13.33,32.23
  Bottom 1.016: v13.33,29.06 13.33,27.15 v13.33,26.52 | C11.1 59.05,47.47 57.15,45.57 v57.15,30.33 50.16,30.33 v45.72,25.88 | v64.77,50.01 78.1,50.01 C12.1 80.64,51.28 97.15,51.28 v97.78,51.92 | C7.+ 25.52,6.96 v30.47,11.91
  Bottom 1.27: P1.A9 7.62,30.96 8.25,30.33 8.25,31.6 | 8.25,27.79 8.25,29.69
  pour Top (isolate 1.016): 10.79,98.27 10.79,88.11 45.72,88.11 46.35,87.48 46.35,84.94 85.08,84.94 99.05,70.97 99.05,98.27
  pour Top (isolate 1.016): 31.11,11.91 31.11,21.44 35.55,21.44 35.55,32.23 48.26,32.23 50.16,34.14 50.16,39.85 55.24,39.85 55.88,39.22 55.88,34.14
  pour Top (isolate 1.016): 19.04,1.12 19.04,34.14 19.68,34.77 12.06,34.77 12.06,1.12
LVD0
  Top 0.254: U1.2_1 52.7,63.98 67.3,49.38 IC9.21 67.3,46.2 67.94,45.57 67.94,42.39 67.3,41.12 67.94,39.85 67.94,36.04 67.3,35.41 67.3,32.23 67.94,31.6 IC8.18 67.94,29.69
  Bottom 0.254: IC6.18 48.89,51.92 52.7,55.73 U1.2_1
LVD1
  Top 0.254: U1.2_2 55.24,62.71 68.57,49.38 IC9.20 68.57,43.03 69.84,41.76 69.84,40.49 69.21,39.85 69.21,36.04 68.57,35.41 68.57,34.77 70.48,32.87 IC8.16
  Bottom 0.254: IC6.17 47.62,49.38 55.24,57 U1.2_2
LVD2
  Top 0.254: U1.2_3 57.78,61.44 69.84,49.38 IC9.19 69.84,44.93 71.75,43.03 71.75,41.12 73.02,39.85 IC8.14
  Bottom 0.254: IC6.16 46.35,46.84 57.78,58.27 U1.2_3
LVD3
  Top 0.254: U1.2_4 60.32,60.17 71.11,49.38 IC9.18 71.11,44.3 72.38,43.03 72.38,41.76 74.29,39.85 74.29,33.5 75.56,32.23 IC8.12
  Bottom 0.254: IC6.15 45.08,44.3 60.32,59.54 U1.2_4
LVD4  (via drill 0.7)
  Top 0.254: 72.38,48.11 72.38,49.38 62.86,58.9 U1.2_5 | IC8.3 v67.94,27.15 | 72.38,48.11 IC9.17 | v72.38,44.93 72.38,48.11
  Bottom 0.254: IC6.14 45.72,41.76 46.35,42.39 46.35,44.3 62.86,60.81 U1.2_5 | v67.94,27.15 67.94,28.42 67.3,29.06 67.3,35.41 71.11,39.22 71.11,43.66 v72.38,44.93
LVD5  (via drill 0.7)
  Top 0.254: 73.66,48.11 73.66,49.38 65.4,57.63 U1.2_6 | IC8.5 70.48,25.25 71.11,25.88 v71.11,33.5 | 73.66,48.11 IC9.16 | 73.66,48.11 v73.66,41.76
  Bottom 0.254: IC6.13 47.62,42.39 47.62,44.3 65.4,62.08 U1.2_6 | v71.11,33.5 72.38,34.77 72.38,40.49 v73.66,41.76
LVD6
  Top 0.254: U1.2_7 67.94,56.36 74.92,49.38 IC9.15 74.92,43.03 75.56,42.39 75.56,34.77 77.46,32.87 77.46,27.15 74.92,24.61 74.29,24.61 73.02,23.34 IC8.7 73.02,20.17
  Bottom 0.254: IC6.12 46.35,38.58 46.35,39.85 48.89,42.39 48.89,44.3 67.94,63.35 U1.2_7
LVD7
  Top 0.254: U1.2_8 70.48,55.09 76.19,49.38 IC9.14 76.19,43.66 76.83,43.03 76.83,41.12 78.1,39.85 78.1,26.52 75.56,23.98 IC8.9 75.56,20.17
  Bottom 0.254: IC6.11 47.62,37.31 47.62,39.85 50.16,42.39 50.16,44.3 70.48,64.62 U1.2_8
LVIOR  (via drill 0.7)
  Top 0.254: v87.62,59.54 87.62,58.9 91.44,55.09 IC10.18 | IC7.12 v83.18,76.68
  Bottom 0.254: v87.62,59.54 85.08,59.54 83.18,61.44 U1.2_13 v83.18,76.68
LVIOW  (via drill 0.7)
  Top 0.254: IC10.19 90.16,53.82 85.72,58.27 v85.72,61.44 | IC7.15 v85.72,84.3
  Bottom 0.254: v85.72,61.44 U1.2_14 v85.72,84.3
LVRES  (via drill 0.7)
  Top 0.254: v82.55,9.37 82.55,44.3 83.81,45.57 85.08,45.57 85.72,46.2 85.72,50.01 79.37,56.36 79.37,68.43 80.64,69.7 89.53,69.7 90.8,68.43 U1.2_16
  Bottom 0.254: JP4.2 v82.55,9.37
LVRES1  (via drill 0.7)
  Top 0.254: R1.1 41.91,13.18 v43.81,15.09
  Bottom 0.254: R2.2 R1.1 | v43.81,15.09 62.23,15.09 64.13,13.18 JP4.3
LVRES2  (via drill 0.7)
  Top 0.254: IC10.20 88.89,45.57 88.26,44.93 88.26,35.41 86.35,33.5 86.35,14.45 85.72,13.82 v85.72,6.83
  Bottom 0.254: JP4.1 v85.72,6.83
N$1  (via drill 0.7)
  Top 0.254: IC3.3 10.16,55.09 9.52,54.46 9.52,35.41 10.16,34.77 17.77,34.77 v20.31,32.23
  Bottom 0.254: v20.31,32.23 27.93,32.23 28.57,32.87 JP5.2
N$2
  Top 0.305: U1.2_15 88.26,65.89 84.45,62.08 84.45,57.63 85.08,57 R3.2
N$14  (via drill 0.7)
  Top 0.254: IC4.13 29.2,79.22 33.02,75.41 33.02,68.43 34.92,66.52 38.73,66.52 43.18,62.08 43.18,58.9 v42.54,58.27 | v53.34,17.63 53.34,10.64 54.61,9.37 JP3.2
  Bottom 0.254: v42.54,58.27 42.54,57.63 41.27,56.36 41.27,25.25 49.53,17.63 v53.34,17.63
N$15  (via drill 0.7)
  Top 0.254: IC10.22 86.35,44.3 85.72,43.66 85.72,35.41 83.81,33.5 v83.81,8.1
  Bottom 0.254: v83.81,8.1 62.23,8.1 60.96,9.37 JP1.2
N$16  (via drill 0.7)
  Top 0.254: JP2.2 49.53,9.37 48.26,10.64 v48.26,24.61 | v55.88,28.42 55.88,33.5 v64.13,33.5 | 66.03,48.11 IC9.22 v66.03,44.93
  Bottom 0.254: v48.26,24.61 48.26,27.15 49.53,28.42 v55.88,28.42 | v64.13,33.5 64.13,40.49 62.86,41.76 62.86,42.39 v66.03,44.93
PHI2
  Bottom 0.254: P1.C26 11.43,74.14 15.24,77.95 15.24,81.13 18.41,84.3 IC4.2
R/-W  (via drill 0.7)
  Top 0.254: P1.C25 8.25,69.06 8.25,27.79 7.62,27.15 v7.62,24.61
  Bottom 0.254: P1.C25 16.5,77.32 16.5,80.49 17.77,81.76 IC4.3 IC4.14 | v7.62,24.61 21.58,24.61 25.39,20.8 IC5.11
RES  (via drill 0.7)
  Top 0.254: 86.35,36.04 IC10.3 | 86.35,36.04 87.62,36.04 IC10.4 | v85.08,15.09 85.08,33.5 86.35,34.77 86.35,36.04 | v44.45,16.36 43.18,16.36 40,13.18 36.19,13.18 R1.2
  Bottom 0.254: IC5.12 28.57,23.34 29.84,22.07 29.84,15.09 33.65,11.28 R1.2 | v85.08,15.09 69.21,15.09 68.57,14.45 64.13,14.45 62.86,15.72 45.08,15.72 v44.45,16.36
VCC  (via drill 0.7)
  Top 0.254: 24.76,50.01 IC3.16 | 24.76,39.85 IC3.12 | 55.24,1.75 JP3.1
  Top 0.61: C3.1 27.3,88.11 IC4.16 | 26.66,86.84 24.76,84.94 C2.1 27.3,61.44 | IC3.20 27.3,61.44 | 26.66,60.17 24.76,58.27 24.76,50.01 24.76,39.85 C1.1 27.3,30.96 IC5.14 | 26.66,28.42 24.76,26.52 v24.76,11.28 | 27.3,61.44 27.93,62.08 v32.38,62.08 | IC9.1 63.5,36.68 61.59,36.68 C4.1 v55.24,39.22 | IC10.1 v83.81,36.04 85.08,36.04 IC10.2 | 80.64,1.75 v80.64,37.31 | v59.69,27.79 59.69,25.88 55.88,22.07 55.88,17.63 54.61,16.36 v54.61,13.82 | 46.98,1.75 v46.98,8.74 | IC6.20 47.62,57 48.89,55.73 48.89,50.01 v55.24,43.66 | 83.81,37.95 83.81,41.12 85.08,41.12 | 85.08,41.12 85.08,37.95 | 85.08,41.12 85.08,42.39 v84.45,43.03 | v81.91,50.01 80.64,51.28 v77.46,51.28
  Top 0.813: v77.46,51.28 76.19,51.28 71.75,55.73 v71.75,63.98 | v36.19,93.83 26.03,93.83 C3.1 | v38.73,93.83 v48.89,93.83
  Top 1.016: 26.66,86.84 IC4.16 | 26.66,60.17 IC3.20 | 26.66,28.42 IC5.14 | v24.76,11.28 28.57,11.28 31.74,8.1 31.74,1.75 46.98,1.75 55.24,1.75 80.64,1.75
  Bottom 0.254: JP2.3 51.43,11.91 52.7,10.64 52.7,8.74 54.61,6.83 JP3.1 55.88,6.83 57.15,8.1 57.15,10.01 59.05,11.91 JP1.3 | IC3.16 IC3.5 | IC5.14 27.93,28.42 29.84,30.33 JP5.1
  Bottom 0.61: v32.38,62.08 40.64,62.08 C9.1 43.18,60.81 44.45,59.54 IC6.20 | C5.1 v80.64,37.31 81.91,36.04 v83.81,36.04 | C4.1 60.32,28.42 v59.69,27.79 | v54.61,13.82 48.26,13.82 46.98,12.55 v46.98,8.74 | v55.24,39.22 v55.24,43.66 55.24,45.57 60.96,51.28 v77.46,51.28 | v84.45,43.03 84.45,45.57 82.55,47.47 82.55,49.38 v81.91,50.01 | v71.75,63.98 71.75,68.43
  Bottom 0.813: 71.75,68.43 70.48,69.7 50.16,69.7 48.89,70.97 v48.89,93.83 | v36.19,93.83 v38.73,93.83
  Bottom 1.016: C6.+ 16.5,6.83 | v24.76,11.28 20.95,11.28 16.5,6.83 | 16.5,6.83 16.5,7.47 P1.C2 P1.C3
  pour Top (isolate 1.016): 20.95,13.18 20.95,1.12 81.27,1.12 81.27,23.34 48.89,23.34 47.62,24.61 31.11,9.37
W/-R  (via drill 0.7)
  Top 0.254: IC5.10 34.92,18.26 v43.18,25.88 | v52.7,34.77 64.77,34.77 IC9.2
  Bottom 0.254: v43.18,25.88 v52.7,34.77

### Text on the board
Top: $8Cx | $8Dx | '244/'50 | (C) A. Fachat | '4245 | CSA-ETHOLI-V1.0B
tPlace: Alternative | $8Cx | $8Dx | '244/'50 | (C) A. Fachat | '4245 | CSA-ETHOLI-V1.0B